# EAGLE design DESIGN8SM (EAGLE 9.6.2)
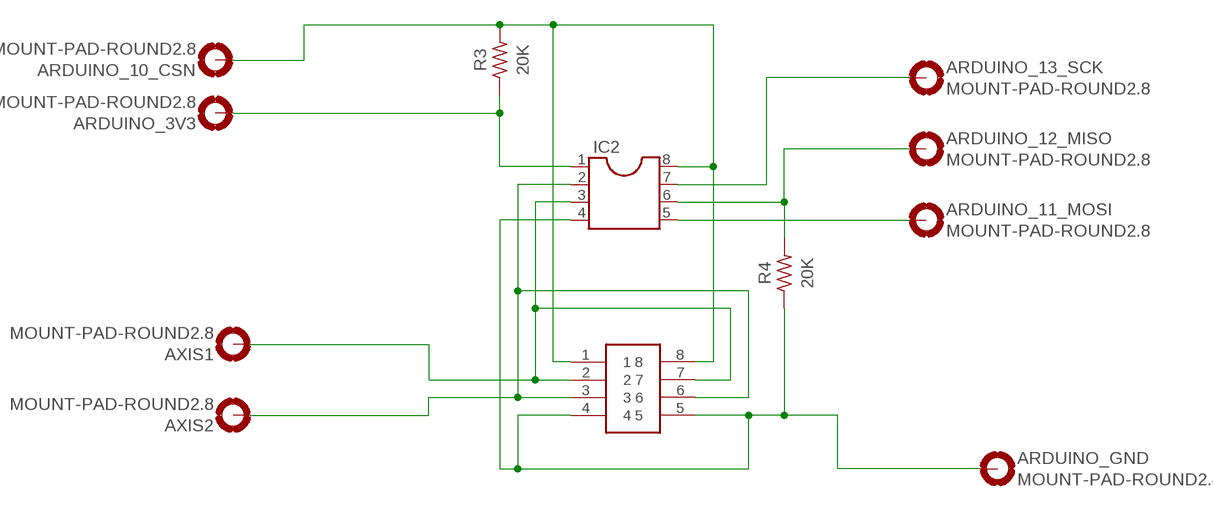
[diagram p0: schematic, sheet 1]

## Parts
ARDUINO_3V3  MOUNT-PAD-ROUND2.8  [2,8-PAD]
ARDUINO_10_CSN  MOUNT-PAD-ROUND2.8  [2,8-PAD]
ARDUINO_11_MOSI  MOUNT-PAD-ROUND2.8  [2,8-PAD]
ARDUINO_12_MISO  MOUNT-PAD-ROUND2.8  [2,8-PAD]
ARDUINO_13_SCK  MOUNT-PAD-ROUND2.8  [2,8-PAD]
ARDUINO_GND  MOUNT-PAD-ROUND2.8  [2,8-PAD]
AXIS1  MOUNT-PAD-ROUND2.8  [2,8-PAD]
AXIS2  MOUNT-PAD-ROUND2.8  [2,8-PAD]
IC2  DIL8S  [SOCKET-08]
R3  20K  R-US_AXIAL-11.7MM-PITCH  [RESAD1176W63L850D250B]
R4  20K  R-US_AXIAL-11.7MM-PITCH  [RESAD1176W63L850D250B]
U$2  JOYSTICK  [JOYSTICK]

## Nets
N$1: ARDUINO_GND.B2,8(MOUNT) IC2.4 R4.1 U$2.4 U$2.5
N$2: AXIS1.B2,8(MOUNT) IC2.3 U$2.2 U$2.7
N$3: AXIS2.B2,8(MOUNT) IC2.2 U$2.3 U$2.6
N$4: ARDUINO_10_CSN.B2,8(MOUNT) IC2.8 R3.2 U$2.1 U$2.8
N$5: ARDUINO_3V3.B2,8(MOUNT) IC2.1 R3.1
N$6: ARDUINO_11_MOSI.B2,8(MOUNT) IC2.5
N$7: ARDUINO_12_MISO.B2,8(MOUNT) IC2.6 R4.2
N$8: ARDUINO_13_SCK.B2,8(MOUNT) IC2.7

## Library data of the parts
ARDUINO_3V3 ARDUINO_10_CSN ARDUINO_11_MOSI ARDUINO_12_MISO ARDUINO_13_SCK ARDUINO_GND AXIS1 AXIS2 = holes:MOUNT-PAD-ROUND: MOUNTING PAD, round
IC2 = ic-package:DIL8: Dual In Line / Socket
R3 R4 = Resistor:R-US: Resistor Fixed - ANSI; CATEGORY: Resistor; SUB-CATEGORY: Fixed
U$2 = JOYSTICK:JOYSTICK

## Board
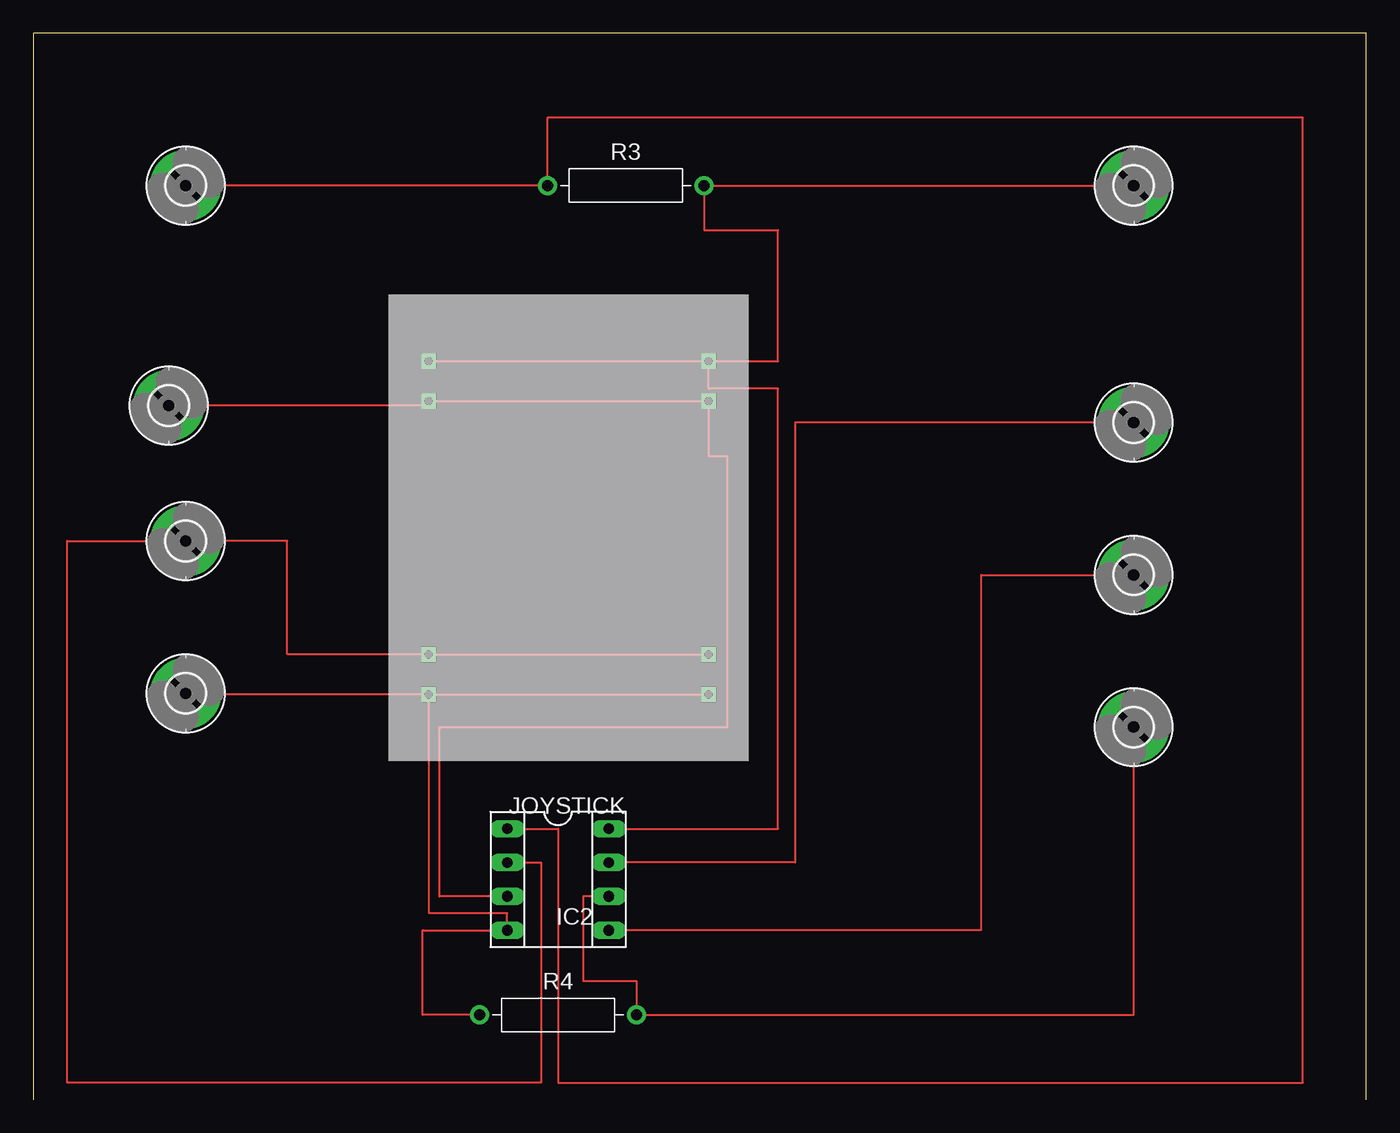
[diagram p1: board, top side]
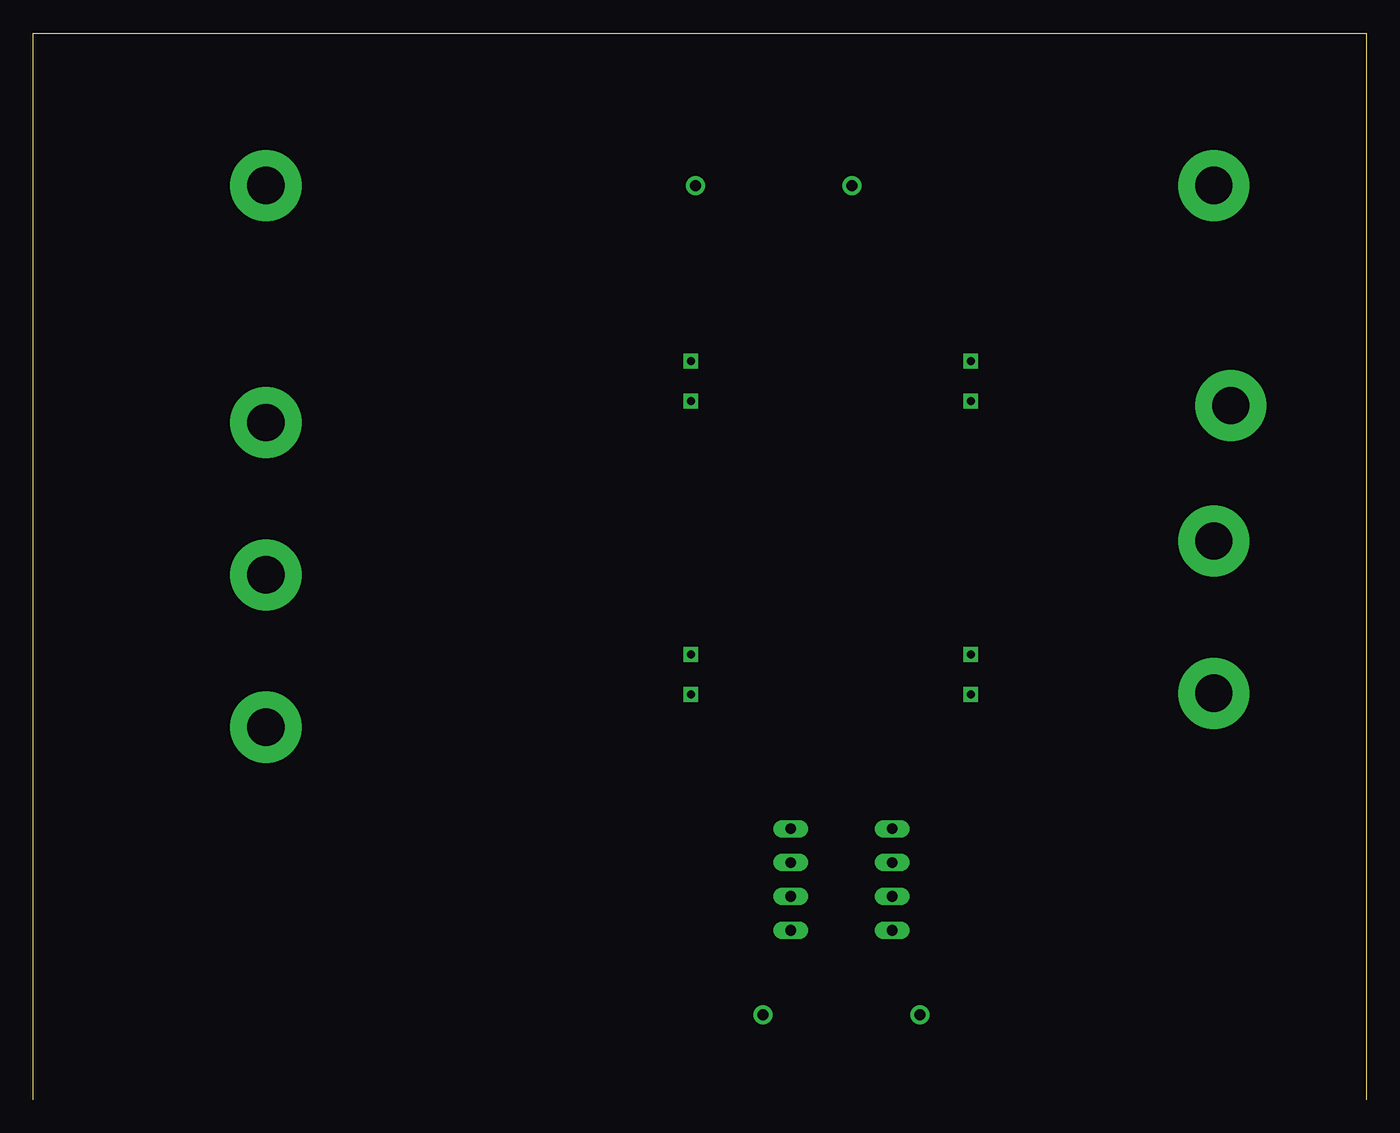
[diagram p2: board, bottom side, seen from below]

Size 100 x 80 mm. Coordinates in mm from the lower left corner, seen from the top.
Outline: 100,0 100,80 0,80 0,0
Copper layers (1*16): Top 0.035mm / dielectric 1.5mm / Bottom 0.035mm
Design rules "default": minimum track width 6mil, minimum drill 0.35mm, track to track 6mil, track to pad 6mil, pad to pad 6mil, via to via 6mil, smd to smd 6mil, copper to edge 40mil, drill to drill 6mil, minimum pad ring 10mil, minimum via ring 8mil, stop-mask expansion 4mil, vias tented up to drill 0mil, thermal gap 10mil

### Footprints (pad centres in the part's own frame; a part is rotated, then mirrored left to right if it is on the bottom)
2,8-PAD = drill 2.8 pad 5.334: B2,8 0,0
SOCKET-08 = drill 0.813 long: 1 -3.81,-3.81; 2 -1.27,-3.81; 3 1.27,-3.81; 4 3.81,-3.81; 5 3.81,3.81; 6 1.27,3.81; 7 -1.27,3.81; 8 -3.81,3.81
RESAD1176W63L850D250B = drill 0.83 pad 1.43: 1 -5.88,0; 2 5.88,0
JOYSTICK = drill 0.6 square: 1 3,30; 2 3,27; 3 3,8; 4 3,5; 5 24,5; 6 24,8; 7 24,27; 8 24,30

### Placement (x,y rotation side)
ARDUINO_3V3  11.43,68.58 0 top
ARDUINO_10_CSN  82.55,68.58 0 top
ARDUINO_11_MOSI  82.55,39.37 0 top
ARDUINO_12_MISO  82.55,27.94 0 top
ARDUINO_13_SCK  82.55,50.8 0 top
ARDUINO_GND  11.43,30.48 0 top
AXIS1  10.16,52.07 0 top
AXIS2  11.43,41.91 0 top
IC2  39.37,16.51 270 top
R3  44.45,68.58 0 top
R4  39.37,6.35 0 top
U$2  26.67,25.4 0 top

### Tracks (layer width: path | path; a pad name or v marks a point on that pad's centre or on a via)
N$1
  Top 0.152: U$2.4 U$2.5 | R4.1 29.21,6.35 29.21,12.7 IC2.4 35.56,13.97 29.67,13.97 U$2.4 | ARDUINO_GND.B2,8 11.51,30.4 U$2.4
N$2
  Top 0.152: 50.7,52.38 U$2.7 | 50.7,52.38 U$2.7 U$2.2 29.34,52.07 AXIS1.B2,8 | IC2.3 30.48,15.24 30.48,27.94 52.07,27.94 52.07,48.26 50.7,48.26 50.7,52.38
N$3
  Top 0.152: 29.67,33.48 U$2.3 | U$2.3 U$2.6 | U$2.3 19.05,33.4 19.05,41.91 AXIS2.B2,8 2.54,41.91 2.54,1.27 38.1,1.27 38.1,17.78 IC2.2
  Bottom 0.152: 50.7,33.48 U$2.6
N$4
  Top 0.152: 50.7,55.42 U$2.8 | U$2.1 U$2.8 | ARDUINO_10_CSN.B2,8 R3.2 50.33,65.24 55.88,65.24 55.88,55.4 U$2.8 | IC2.8 55.88,20.32 55.88,53.34 50.67,53.34 U$2.8
N$5
  Top 0.152: 11.43,68.63 ARDUINO_3V3.B2,8 R3.1 38.57,73.66 95.25,73.66 95.25,1.27 39.37,1.27 39.37,20.32 IC2.1
  Bottom 0.152: 35.46,20.32 IC2.1
N$6
  Top 0.152: IC2.5 71.12,12.7 71.12,39.37 ARDUINO_11_MOSI.B2,8
N$7
  Top 0.152: ARDUINO_12_MISO.B2,8 82.55,6.35 R4.2 45.25,8.89 41.26,8.89 41.26,15.24 IC2.6
N$8
  Top 0.152: ARDUINO_13_SCK.B2,8 57.15,50.8 57.15,17.78 IC2.7